# EAGLE design ocape (EAGLE 6.5.0)
AUTHOR: Brad Campbell; REV: A; TITLE: Observer Cape
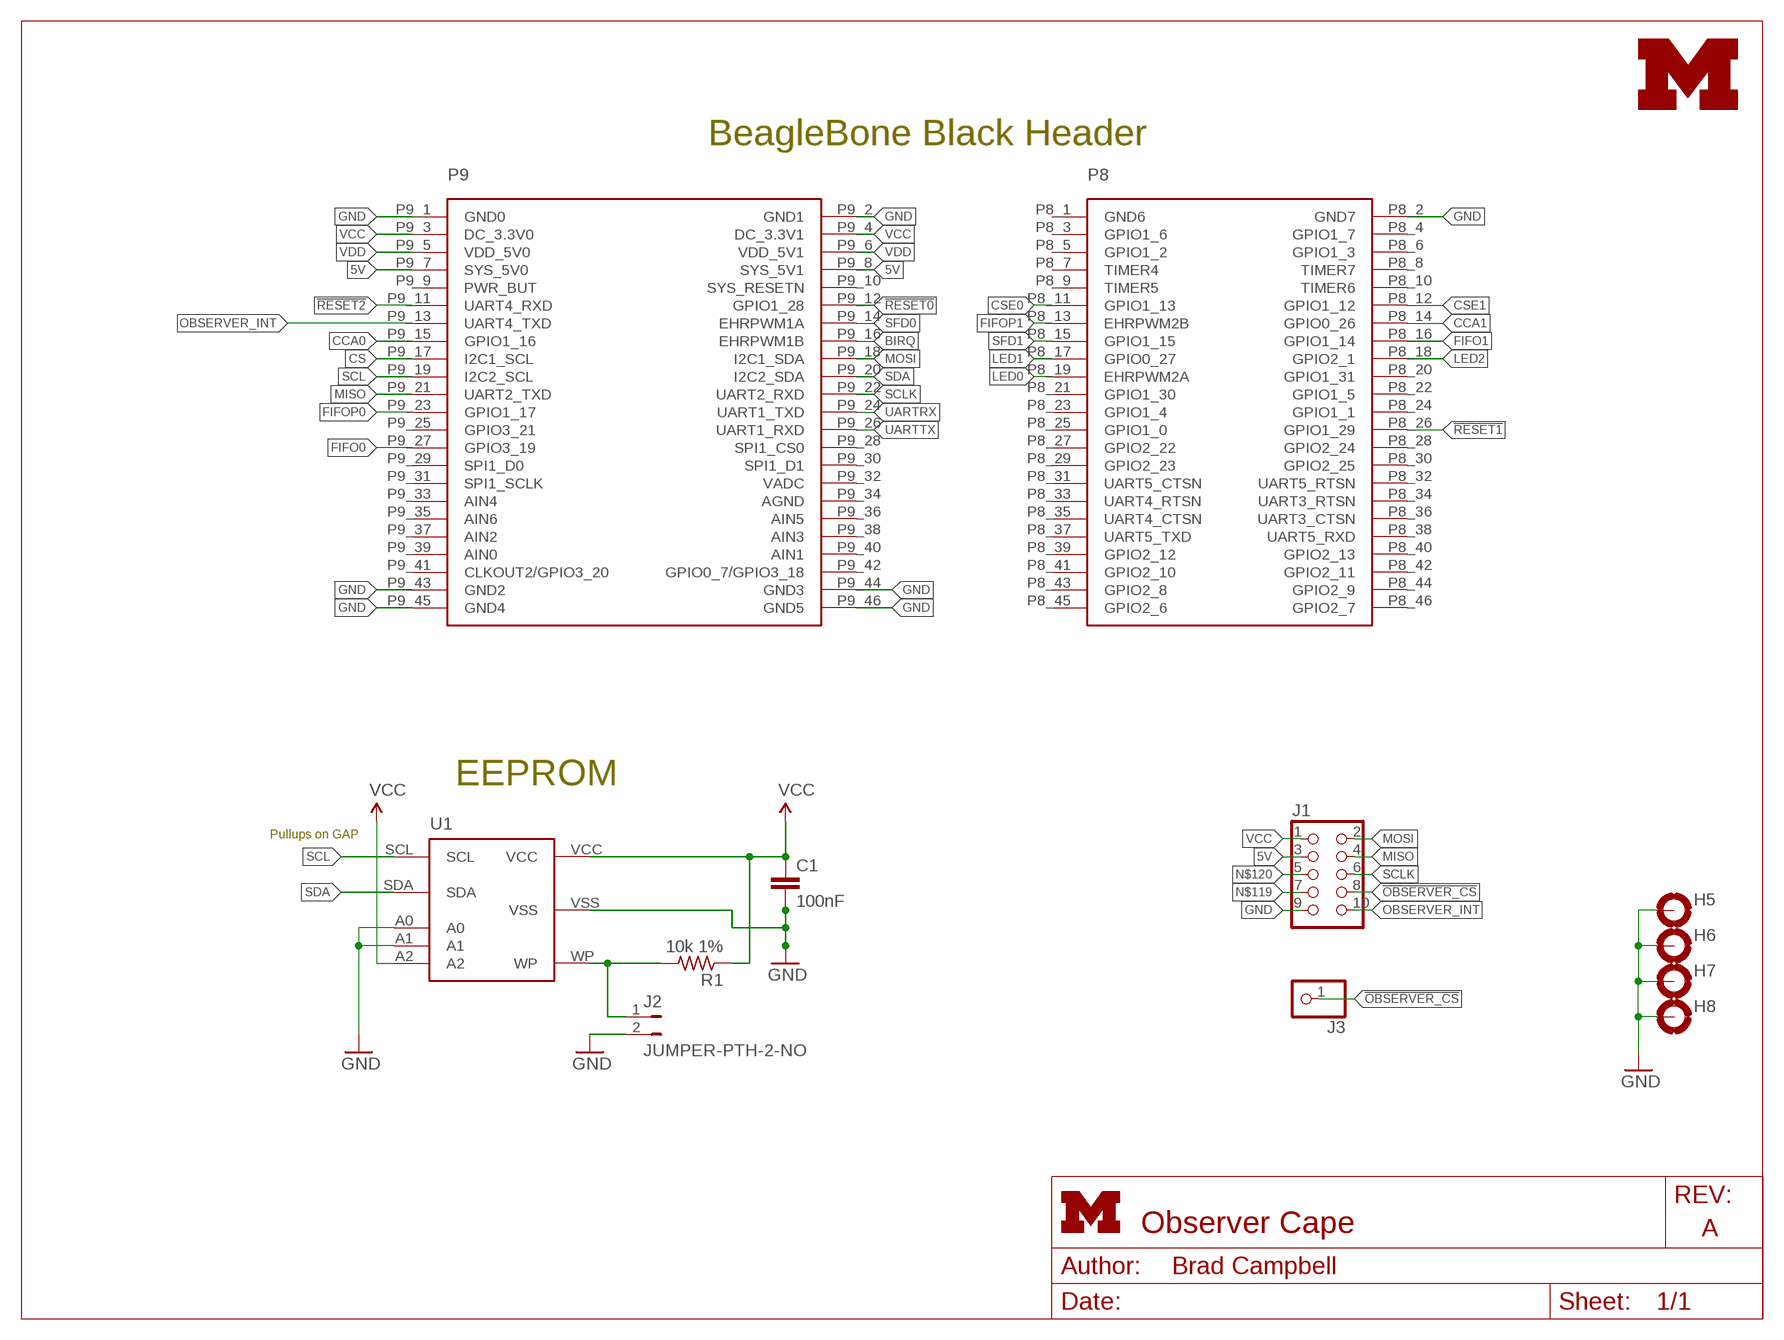
[diagram p0: schematic, sheet 1]
FRAME1 (LETTER_L): HEIGHT: 8.5in; WIDTH: 11in

## Parts
C1  100nF  C-EUC0402  [C0402]
H5  MOUNT-PAD-ROUND3.2  [3,2-PAD]
H6  MOUNT-PAD-ROUND3.2  [3,2-PAD]
H7  MOUNT-PAD-ROUND3.2  [3,2-PAD]
H8  MOUNT-PAD-ROUND3.2  [3,2-PAD]
J1  CON_HEADER_2X05-PTH+SHROUDED_A  [PINSHRD_PTH_2X05]
J2  JUMPER-PTH-2-NO  [PTH-JUMPER-2-NO_NO_SILK]
J3  PINHD-1X1  [1X01]
LOGO1  UMICH_SOLID_SMALL  [UMICH_SOLID_75MIL]
P9/P8  BBB_HEADERS  [BBB_HEADERS]
R1  10k 1%  R-US_R0402  [R0402]
U1  CAT24C256WI-GT3  [CAT24C256WI-GT3]

## Nets
5V: J1.3 P9/P8.P9_7(SYS_5V0) P9/P8.P9_8(SYS_5V1)
!OBSERVER_CS: J1.8 J3.1
!RESET0: P9/P8.P9_12(GPIO1_28)
!RESET1: P9/P8.P8_26(GPIO1_29)
!RESET2: P9/P8.P9_11(UART4_RXD)
BIRQ: P9/P8.P9_16(EHRPWM1B)
CCA0: P9/P8.P9_15(GPIO1_16)
CCA1: P9/P8.P8_14(GPIO0_26)
CS: P9/P8.P9_17(I2C1_SCL)
CSE0: P9/P8.P8_11(GPIO1_13)
CSE1: P9/P8.P8_12(GPIO1_12)
FIFO0: P9/P8.P9_27(GPIO3_19)
FIFO1: P9/P8.P8_16(GPIO1_14)
FIFOP0: P9/P8.P9_23(GPIO1_17)
FIFOP1: P9/P8.P8_13(EHRPWM2B)
GND: C1.2 H5.B3,2(MOUNT) H6.B3,2(MOUNT) H7.B3,2(MOUNT) H8.B3,2(MOUNT) J1.9 J2.2 P9/P8.P8_2(GND7) P9/P8.P9_1(GND0) P9/P8.P9_2(GND1) P9/P8.P9_43(GND2) P9/P8.P9_44(GND3) P9/P8.P9_45(GND4) P9/P8.P9_46(GND5) U1.A0 U1.A1 U1.VSS
LED0: P9/P8.P8_19(EHRPWM2A)
LED1: P9/P8.P8_17(GPIO0_27)
LED2: P9/P8.P8_18(GPIO2_1)
MISO: J1.4 P9/P8.P9_21(UART2_TXD)
MOSI: J1.2 P9/P8.P9_18(I2C1_SDA)
N$31: J2.1 R1.2 U1.WP
N$119: J1.7
N$120: J1.5
OBSERVER_INT: J1.10 P9/P8.P9_13(UART4_TXD)
SCL: P9/P8.P9_19(I2C2_SCL) U1.SCL
SCLK: J1.6 P9/P8.P9_22(UART2_RXD)
SDA: P9/P8.P9_20(I2C2_SDA) U1.SDA
SFD0: P9/P8.P9_14(EHRPWM1A)
SFD1: P9/P8.P8_15(GPIO1_15)
UARTRX: P9/P8.P9_24(UART1_TXD)
UARTTX: P9/P8.P9_26(UART1_RXD)
VCC: C1.1 J1.1 P9/P8.P9_3(DC_3.3V0) P9/P8.P9_4(DC_3.3V1) R1.1 U1.A2 U1.VCC
VDD: P9/P8.P9_5(VDD_5V0) P9/P8.P9_6(VDD_5V1)
Unconnected: P9/P8.P8_1(GND6) P9/P8.P8_3(GPIO1_6) P9/P8.P8_4(GPIO1_7) P9/P8.P8_5(GPIO1_2) P9/P8.P8_6(GPIO1_3) P9/P8.P8_7(TIMER4) P9/P8.P8_8(TIMER7) P9/P8.P8_9(TIMER5) P9/P8.P8_10(TIMER6) P9/P8.P8_20(GPIO1_31) P9/P8.P8_21(GPIO1_30) P9/P8.P8_22(GPIO1_5) P9/P8.P8_23(GPIO1_4) P9/P8.P8_24(GPIO1_1) P9/P8.P8_25(GPIO1_0) P9/P8.P8_27(GPIO2_22) P9/P8.P8_28(GPIO2_24) P9/P8.P8_29(GPIO2_23) P9/P8.P8_30(GPIO2_25) P9/P8.P8_31(UART5_CTSN) P9/P8.P8_32(UART5_RTSN) P9/P8.P8_33(UART4_RTSN) P9/P8.P8_34(UART3_RTSN) P9/P8.P8_35(UART4_CTSN) P9/P8.P8_36(UART3_CTSN) P9/P8.P8_37(UART5_TXD) P9/P8.P8_38(UART5_RXD) P9/P8.P8_39(GPIO2_12) P9/P8.P8_40(GPIO2_13) P9/P8.P8_41(GPIO2_10) P9/P8.P8_42(GPIO2_11) P9/P8.P8_43(GPIO2_8) P9/P8.P8_44(GPIO2_9) P9/P8.P8_45(GPIO2_6) P9/P8.P8_46(GPIO2_7) P9/P8.P9_9(PWR_BUT) P9/P8.P9_10(SYS_RESETN) P9/P8.P9_25(GPIO3_21) P9/P8.P9_28(SPI1_CS0) P9/P8.P9_29(SPI1_D0) P9/P8.P9_30(SPI1_D1) P9/P8.P9_31(SPI1_SCLK) P9/P8.P9_32(VADC) P9/P8.P9_33(AIN4) P9/P8.P9_34(AGND) P9/P8.P9_35(AIN6) P9/P8.P9_36(AIN5) P9/P8.P9_37(AIN2) P9/P8.P9_38(AIN3) P9/P8.P9_39(AIN0) P9/P8.P9_40(AIN1) P9/P8.P9_41(CLKOUT2/GPIO3_20) P9/P8.P9_42(GPIO0_7/GPIO3_18)

## Notes on the sheet
- BeagleBone Black Header
- EEPROM
- Pullups on GAP

## Library data of the parts
C1 = rcl:C-EU: CAPACITOR, European symbol; DIGIKEY: 490-1318-1-ND
H5-H8 = holes:MOUNT-PAD-ROUND: MOUNTING PAD, round
J1 = dp_devices:CON_HEADER_2X05: 2x05 pin header
J2 = SparkFun-Passives:JUMPER-PTH-2-NO
J3 = pinhead:PINHD-1X1: PIN HEADER
LOGO1 = logos:UMICH_SOLID
P9/P8 = bbb-cc2520:BBB_HEADERS: Pin Header 2x23
R1 = rcl:R-US_: RESISTOR, American symbol; DIGIKEY: RHM1.00MCDCT-ND
U1 = bbb-cc2520:CAT24C256: 256kb Serial CMOS EEPROM, organized as 32,768 words of 8 bits each

## Board
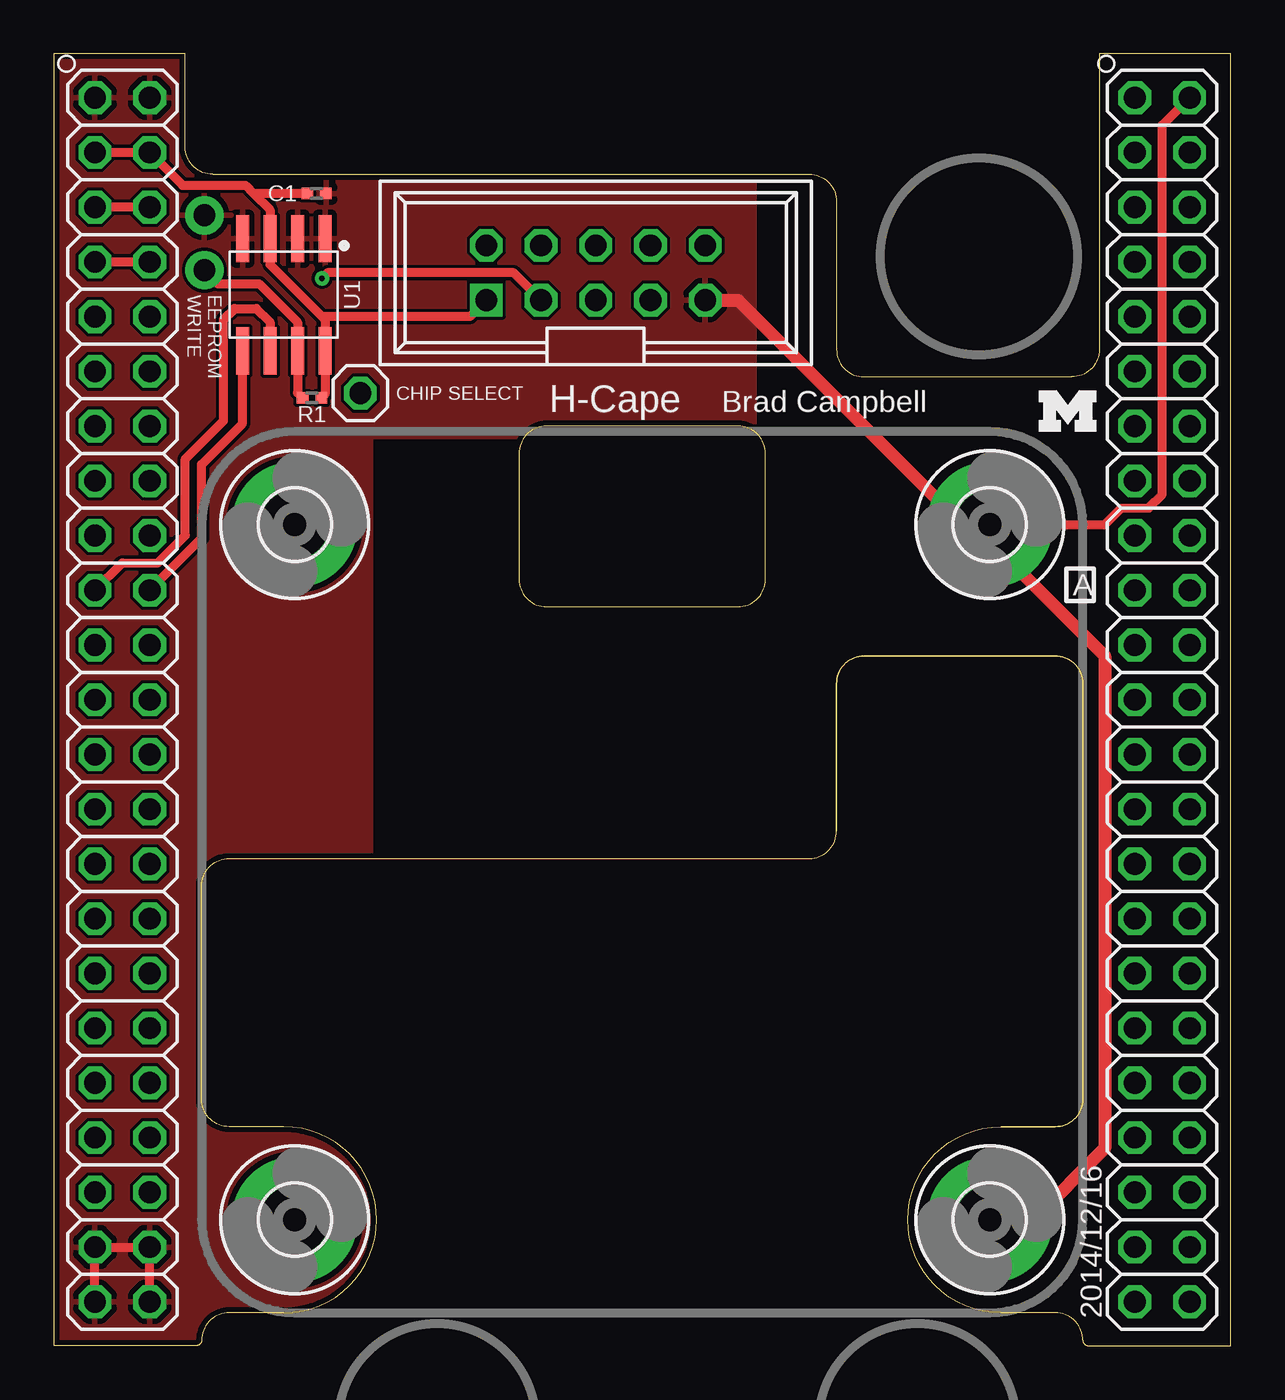
[diagram p1: board, top side]
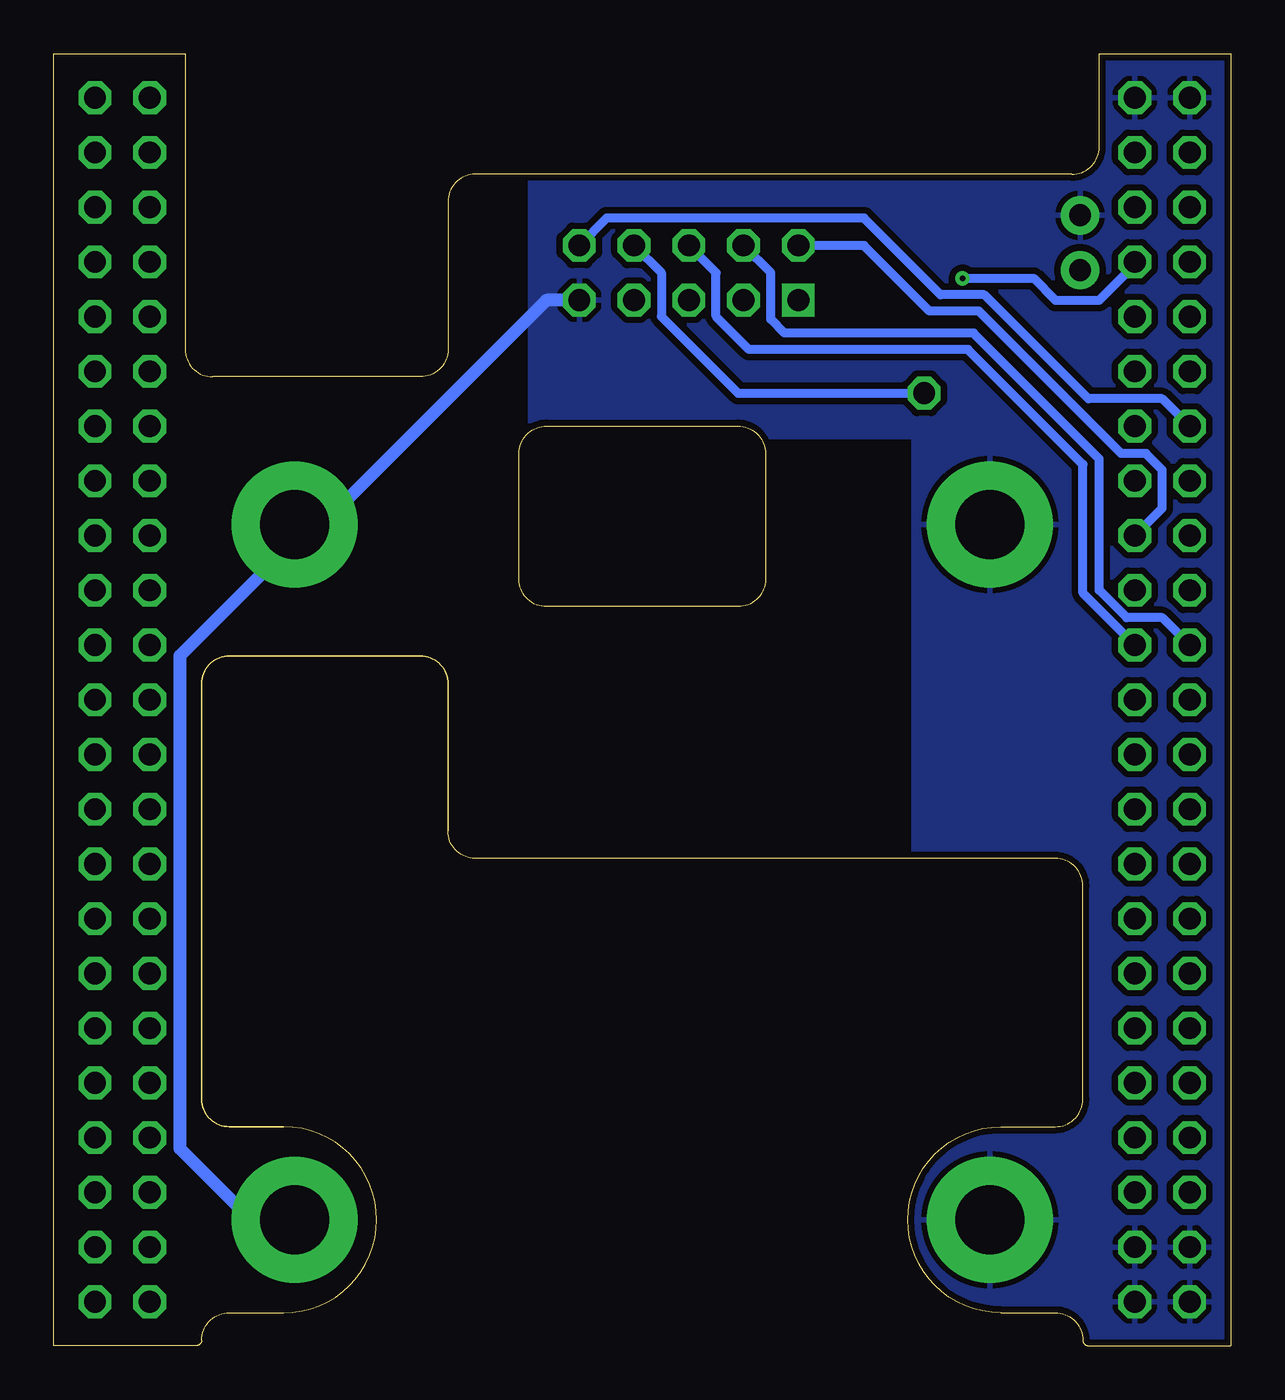
[diagram p2: board, bottom side, seen from below]

Size 54.61 x 59.94 mm. Coordinates in mm from the lower left corner, seen from the top.
Outline: 0,59.94 0,0 6.6,0 arc90 6.86,0.25 arc-90 8.13,1.52 10.67,1.52 arc180 10.67,10.16 8.13,10.16 arc-90 6.86,11.43 6.86,21.34 arc-90 8.13,22.61 35.05,22.61 arc90 36.32,23.88 36.32,30.73 arc-90 37.59,32 46.48,32 arc-90 47.75,30.73 47.75,11.43 arc-90 46.48,10.16 43.94,10.16 arc180 43.94,1.52 46.48,1.52 arc-90 47.75,0.25 arc90 48.01,0 54.61,0 54.61,59.94 48.51,59.94 48.51,46.23 arc-90 47.24,44.96 37.59,44.96 arc-90 36.32,46.23 36.32,53.09 arc90 35.05,54.36 7.37,54.36 arc-90 6.1,55.63 6.1,59.94 0,59.94
Outline: 31.75,42.67 22.86,42.67 arc90 21.59,41.4 21.59,35.56 arc90 22.86,34.29 31.75,34.29 arc90 33.02,35.56 33.02,41.4 arc90 31.75,42.67
Copper layers (1+2*15+16): Top 0.0178mm / dielectric 12mil / GND 0.0356mm / dielectric 28mil / VCC 0.0356mm / dielectric 12mil / Bottom 0.0178mm
Design rules "sunstone-4lyr_v1.0.0.3 *": minimum track width 6mil, minimum drill 8mil, track to track 6mil, track to pad 6mil, pad to pad 6mil, via to via 6mil, smd to smd 6mil, copper to edge 10mil, drill to drill 16mil, minimum pad ring 8mil, minimum via ring 8mil, stop-mask expansion 3mil, vias tented up to drill 25mil, thermal gap 10mil
Milling: 45 lines

### Footprints (pad centres in the part's own frame; a part is rotated, then mirrored left to right if it is on the bottom)
C0402 = smd 0.536 x 0.546: 1 -0.433,0; 2 0.433,0
3,2-PAD = drill 3.2 pad 5.842: B3,2 0,0
PINSHRD_PTH_2X05 = drill 1.016 square: 1 -5.08,-1.27 | drill 1.016 octagon: 2 -5.08,1.27; 3 -2.54,-1.27; 4 -2.54,1.27; 5 0,-1.27; 6 0,1.27; 7 2.54,-1.27; 8 2.54,1.27; 9 5.08,-1.27; 10 5.08,1.27
PTH-JUMPER-2-NO_NO_SILK = drill 1.016 pad 1.778: 1 -1.27,0; 2 1.27,0
1X01 = drill 1.016 octagon: 1 0,0
BBB_HEADERS = drill 1.016 octagon: P8_1 49.53,57.15; P8_2 52.07,57.15; P8_3 49.53,54.61; P8_4 52.07,54.61; P8_5 49.53,52.07; P8_6 52.07,52.07; P8_7 49.53,49.53; P8_8 52.07,49.53; P8_9 49.53,46.99; P8_10 52.07,46.99; P8_11 49.53,44.45; P8_12 52.07,44.45; P8_13 49.53,41.91; P8_14 52.07,41.91; P8_15 49.53,39.37; P8_16 52.07,39.37; P8_17 49.53,36.83; P8_18 52.07,36.83; P8_19 49.53,34.29; P8_20 52.07,34.29; P8_21 49.53,31.75; P8_22 52.07,31.75; P8_23 49.53,29.21; P8_24 52.07,29.21; P8_25 49.53,26.67; P8_26 52.07,26.67; P8_27 49.53,24.13; P8_28 52.07,24.13; P8_29 49.53,21.59; P8_30 52.07,21.59; P8_31 49.53,19.05; P8_32 52.07,19.05; P8_33 49.53,16.51; P8_34 52.07,16.51; P8_35 49.53,13.97; P8_36 52.07,13.97; P8_37 49.53,11.43; P8_38 52.07,11.43; P8_39 49.53,8.89; P8_40 52.07,8.89; P8_41 49.53,6.35; P8_42 52.07,6.35; P8_43 49.53,3.81; P8_44 52.07,3.81; P8_45 49.53,1.27; P8_46 52.07,1.27; P9_1 1.27,57.15; P9_2 3.81,57.15; P9_3 1.27,54.61; P9_4 3.81,54.61; P9_5 1.27,52.07; P9_6 3.81,52.07; P9_7 1.27,49.53; P9_8 3.81,49.53; P9_9 1.27,46.99; P9_10 3.81,46.99; P9_11 1.27,44.45; P9_12 3.81,44.45; P9_13 1.27,41.91; P9_14 3.81,41.91; P9_15 1.27,39.37; P9_16 3.81,39.37; P9_17 1.27,36.83; P9_18 3.81,36.83; P9_19 1.27,34.29; P9_20 3.81,34.29; P9_21 1.27,31.75; P9_22 3.81,31.75; P9_23 1.27,29.21; P9_24 3.81,29.21; P9_25 1.27,26.67; P9_26 3.81,26.67; P9_27 1.27,24.13; P9_28 3.81,24.13; P9_29 1.27,21.59; P9_30 3.81,21.59; P9_31 1.27,19.05; P9_32 3.81,19.05; P9_33 1.27,16.51; P9_34 3.81,16.51; P9_35 1.27,13.97; P9_36 3.81,13.97; P9_37 1.27,11.43; P9_38 3.81,11.43; P9_39 1.27,8.89; P9_40 3.81,8.89; P9_41 1.27,6.35; P9_42 3.81,6.35; P9_43 1.27,3.81; P9_44 3.81,3.81; P9_45 1.27,1.27; P9_46 3.81,1.27
R0402 = smd 0.536 x 0.546: 1 -0.433,0; 2 0.433,0
CAT24C256WI-GT3 = smd 2.2 x 0.6: A0 -2.6,1.91; A1 -2.6,0.65; A2 -2.6,-0.64; SCL 2.6,-0.64; SDA 2.6,-1.91; VCC 2.6,1.91; VSS -2.6,-1.91; WP 2.6,0.64

### Placement (x,y rotation side)
C1  12.19,53.47 0 top
H5  11.18,5.84 0 top
H6  43.43,5.84 0 top
H7  11.18,38.1 0 top
H8  43.43,38.1 0 top
J1  25.15,49.78 0 top
J2  6.99,51.18 90 top
J3  14.22,44.2 0 top
LOGO1  45.72,42.42 0 top
P9/P8  0.64,0.76 0 top
R1  11.98,43.98 180 top
U1  10.67,48.77 270 top

### Tracks (layer width: path | path; a pad name or v marks a point on that pad's centre or on a via)
5V  (via drill 0.25)
  Top 0.406: P9/P8.P9_7 P9/P8.P9_8 | J1.3 21.34,49.78 12.7,49.78 v12.45,49.53
  Bottom 0.406: P9/P8.P9_8 4.45,50.16 6.1,48.51 8.13,48.51 9.14,49.53 v12.45,49.53
!OBSERVER_CS
  Bottom 0.406: J1.8 26.42,49.78 26.42,47.75 22.86,44.2 J3.1
GND
  Top 0.406: P9/P8.P9_46 P9/P8.P9_44 P9/P8.P9_43 P9/P8.P9_45 | H8.B3,2 48.77,38.1 49.53,38.86 50.8,38.86 51.44,39.5 51.44,56.64 P9/P8.P8_2
  Top 0.61: J1.9 31.75,48.51 42.16,38.1 H8.B3,2 43.43,37.34 48.77,32 48.77,9.14 45.47,5.84 H6.B3,2
  Bottom 0.61: J1.9 31.75,48.51 42.16,38.1 H8.B3,2 43.43,37.34 48.77,32 48.77,9.14 45.47,5.84 H6.B3,2
  pour Bottom (isolate 0.305): -1.27,60.96 32.51,60.96 32.51,42.16 14.73,42.16 14.73,-9.4 -1.27,-9.4
  pour Top: 32.51,60.96 -1.27,60.96 -1.27,-9.38 14.73,-9.4 14.73,42.16 32.51,42.16
MISO
  Bottom 0.406: P9/P8.P9_21 3.17,33.78 4.83,33.78 6.1,35.05 6.1,41.15 11.94,46.99 20.7,46.99 21.34,47.62 21.34,49.78 J1.4
MOSI
  Bottom 0.406: P9/P8.P9_18 3.17,38.86 3.17,40.64 3.94,41.4 5.08,41.4 11.68,48.01 13.97,48.01 17.02,51.05 J1.2
N$31
  Top 0.406: R1.2 11.31,44.22 U1.WP 11.31,47.49 9.53,49.28 7.62,49.28 J2.1
OBSERVER_INT
  Bottom 0.406: P9/P8.P9_13 3.17,43.94 6.6,43.94 11.43,48.77 13.46,48.77 17.02,52.32 28.96,52.32 J1.10
SCL
  Top 0.406: P9/P8.P9_19 3.17,36.32 4.83,36.32 6.1,37.59 6.1,41.15 7.87,42.93 7.87,47.62 8.38,48.13 9.4,48.13 10.03,47.5 U1.SCL 10.03,46.35
SCLK
  Bottom 0.406: P9/P8.P9_22 6.86,34.92 6.86,40.89 12.19,46.23 22.35,46.23 23.88,47.75 23.88,49.78 J1.6
SDA
  Top 0.406: P9/P8.P9_20 6.86,37.47 6.86,40.89 8.76,42.79 U1.SDA
VCC
  Top 0.406: P9/P8.P9_3 P9/P8.P9_4 5.97,53.85 8.89,53.85 9.27,53.47 | 9.27,53.47 10.03,52.71 U1.A2 10.03,50.17 12.45,47.75 | C1.1 9.27,53.47 | R1.1 12.58,44.15 U1.VCC 12.58,47.62 12.45,47.75 | J1.1 19.3,47.75 12.45,47.75
VDD
  Top 0.406: P9/P8.P9_6 P9/P8.P9_5

### Text on the board
tPlace: EEPROM / WRITE | CHIP SELECT | H-Cape | Brad Campbell | A | 2014/12/16